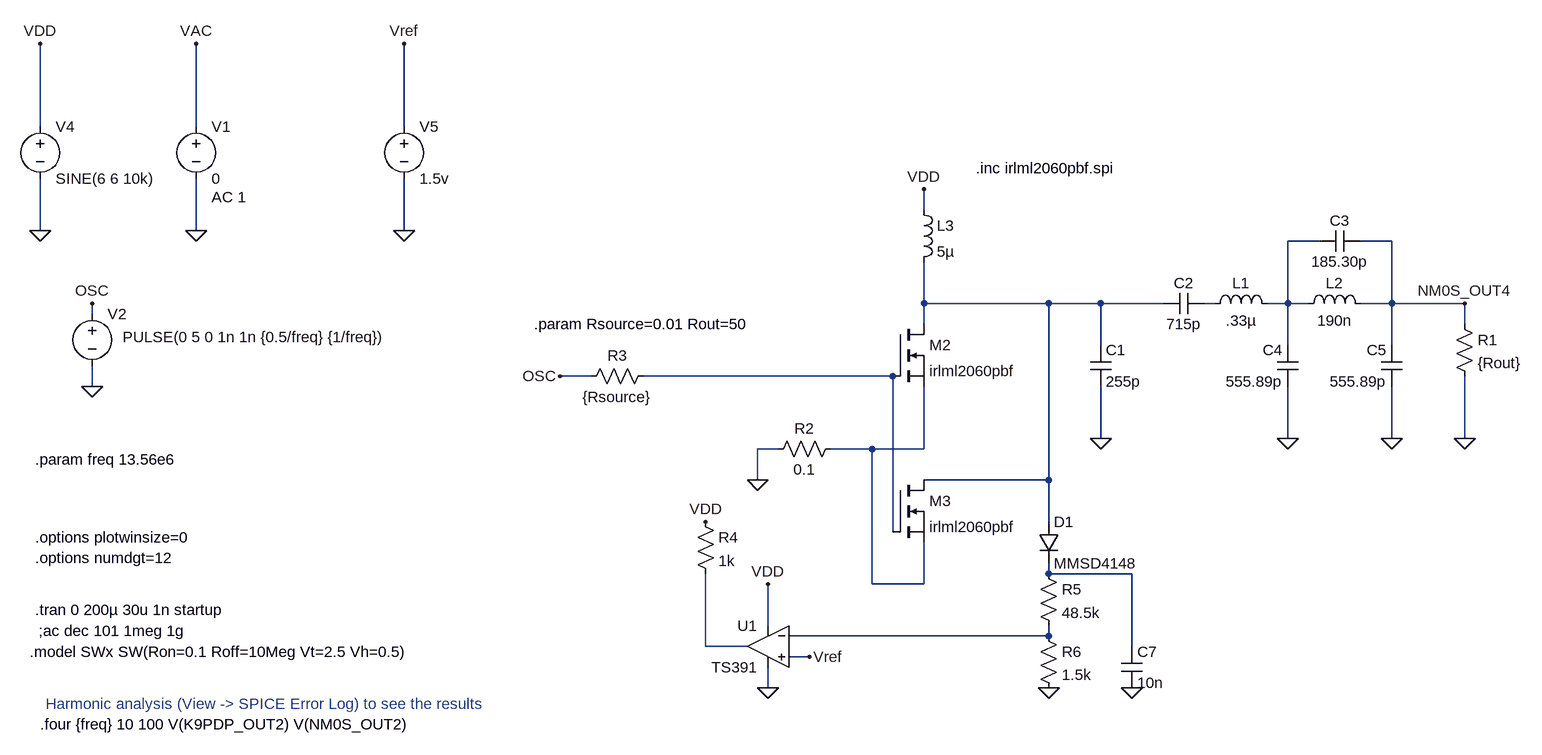
[diagram p0: schematic Class_E_with_transistor_and_gate_driver.asc]
Class_E_with_transistor_and_gate_driver.asc, the LTspice schematic file:
Version 4
SHEET 1 2652 1572
WIRE 352 -48 352 -176
WIRE 592 -48 592 -176
WIRE 912 -48 912 -176
WIRE 1712 80 1712 48
WIRE 352 112 352 32
WIRE 592 112 592 32
WIRE 912 112 912 32
WIRE 2320 128 2272 128
WIRE 2432 128 2384 128
WIRE 1712 224 1712 160
WIRE 1904 224 1712 224
WIRE 1984 224 1904 224
WIRE 2080 224 1984 224
WIRE 2160 224 2144 224
WIRE 2272 224 2272 128
WIRE 2272 224 2240 224
WIRE 2304 224 2272 224
WIRE 2432 224 2432 128
WIRE 2432 224 2384 224
WIRE 2544 224 2432 224
WIRE 432 240 432 224
WIRE 1712 256 1712 224
WIRE 2544 256 2544 224
WIRE 1984 288 1984 224
WIRE 2272 288 2272 224
WIRE 2432 288 2432 224
WIRE 1200 336 1152 336
WIRE 1664 336 1280 336
WIRE 432 352 432 320
WIRE 1984 432 1984 352
WIRE 2272 432 2272 352
WIRE 2432 432 2432 352
WIRE 2544 432 2544 336
WIRE 1488 448 1456 448
WIRE 1632 448 1568 448
WIRE 1712 448 1712 352
WIRE 1712 448 1632 448
WIRE 1456 496 1456 448
WIRE 1904 496 1904 224
WIRE 1904 496 1712 496
WIRE 1904 560 1904 496
WIRE 1664 576 1664 336
WIRE 1904 640 1904 624
WIRE 2032 640 1904 640
WIRE 1632 656 1632 448
WIRE 1712 656 1712 592
WIRE 1712 656 1632 656
WIRE 1472 720 1472 656
WIRE 1904 736 1904 720
WIRE 1904 736 1504 736
WIRE 1376 752 1376 640
WIRE 1440 752 1376 752
WIRE 2032 752 2032 640
WIRE 1536 768 1504 768
WIRE 1472 816 1472 784
FLAG 592 112 0
FLAG 592 -176 VAC
FLAG 432 352 0
FLAG 352 112 0
FLAG 352 -176 VDD
FLAG 432 224 OSC
FLAG 1984 432 0
FLAG 2272 432 0
FLAG 2432 432 0
FLAG 2544 432 0
FLAG 2544 224 NM0S_OUT4
FLAG 1712 48 VDD
FLAG 1152 336 OSC
FLAG 1456 496 0
FLAG 1472 816 0
FLAG 1472 656 VDD
FLAG 1536 768 Vref
FLAG 912 -176 Vref
FLAG 912 112 0
FLAG 1904 816 0
FLAG 2032 816 0
FLAG 1376 560 VDD
SYMBOL voltage 592 -64 R0
WINDOW 123 24 124 Left 2
WINDOW 39 0 0 Left 0
SYMATTR Value2 AC 1
SYMATTR InstName V1
SYMATTR Value 0
SYMBOL voltage 432 224 R0
WINDOW 123 0 0 Left 0
WINDOW 39 0 0 Left 0
WINDOW 3 47 52 Left 2
SYMATTR Value PULSE(0 5 0 1n 1n {0.5/freq} {1/freq})
SYMATTR InstName V2
SYMBOL voltage 352 -64 R0
WINDOW 123 0 0 Left 0
WINDOW 39 0 0 Left 0
SYMATTR InstName V4
SYMATTR Value SINE(6 6 10k)
SYMBOL cap 1968 288 R0
SYMATTR InstName C1
SYMATTR Value 255p
SYMBOL cap 2144 208 R90
WINDOW 0 0 32 VBottom 2
WINDOW 3 32 32 VTop 2
SYMATTR InstName C2
SYMATTR Value 715p
SYMBOL cap 2384 112 R90
WINDOW 0 0 32 VBottom 2
WINDOW 3 32 32 VTop 2
SYMATTR InstName C3
SYMATTR Value 185.30p
SYMBOL cap 2288 352 R180
WINDOW 0 24 56 Left 2
WINDOW 3 24 8 Left 2
SYMATTR InstName C4
SYMATTR Value 555.89p
SYMBOL cap 2448 352 R180
WINDOW 0 24 56 Left 2
WINDOW 3 24 8 Left 2
SYMATTR InstName C5
SYMATTR Value 555.89p
SYMBOL ind 2144 240 R270
WINDOW 0 32 56 VTop 2
WINDOW 3 5 56 VBottom 2
SYMATTR InstName L1
SYMATTR Value .33µ
SYMBOL ind 2288 240 R270
WINDOW 0 32 56 VTop 2
WINDOW 3 5 56 VBottom 2
SYMATTR InstName L2
SYMATTR Value 190n
SYMBOL res 2528 240 R0
SYMATTR InstName R1
SYMATTR Value {Rout}
SYMBOL ind 1696 64 R0
SYMATTR InstName L3
SYMATTR Value 5µ
SYMBOL nmos 1664 256 R0
SYMATTR InstName M2
SYMATTR Value irlml2060pbf
SYMATTR Prefix X
SYMBOL nmos 1664 496 R0
SYMATTR InstName M3
SYMATTR Value irlml2060pbf
SYMATTR Prefix X
SYMBOL res 1296 320 R90
WINDOW 0 0 56 VBottom 2
WINDOW 3 32 56 VTop 2
SYMATTR InstName R3
SYMATTR Value {Rsource}
SYMBOL Parts_TCO\\TS391 1472 688 M0
SYMATTR InstName U1
SYMBOL res 1360 544 R0
SYMATTR InstName R4
SYMATTR Value 1k
SYMBOL voltage 912 -64 R0
WINDOW 123 0 0 Left 0
WINDOW 39 0 0 Left 0
SYMATTR InstName V5
SYMATTR Value 1.5v
SYMBOL diode 1888 560 R0
SYMATTR InstName D1
SYMATTR Value MMSD4148
SYMBOL res 1888 624 R0
SYMATTR InstName R5
SYMATTR Value 48.5k
SYMBOL res 1888 720 R0
SYMATTR InstName R6
SYMATTR Value 1.5k
SYMBOL cap 2016 752 R0
SYMATTR InstName C7
SYMATTR Value 10n
SYMBOL res 1584 432 R90
WINDOW 0 0 56 VBottom 2
WINDOW 3 32 56 VTop 2
SYMATTR InstName R2
SYMATTR Value 0.1
TEXT 576 728 Right 2 !;ac dec 101 1meg 1g
TEXT 336 760 Left 2 !.model SWx SW(Ron=0.1 Roff=10Meg Vt=2.5 Vh=0.5)
TEXT 344 696 Left 2 !.tran 0 200µ 30u 1n startup
TEXT 344 464 Left 2 !.param freq 13.56e6
TEXT 344 616 Left 2 !.options numdgt=12
TEXT 344 584 Left 2 !.options plotwinsize=0
TEXT 352 872 Left 2 !.four {freq} 10 100 V(K9PDP_OUT2) V(NM0S_OUT2)
TEXT 360 840 Left 2 ;Harmonic analysis (View -> SPICE Error Log) to see the results
TEXT 1792 16 Left 2 !.inc irlml2060pbf.spi
TEXT 1112 256 Left 2 !.param Rsource=0.01 Rout=50

The netlist it stands for:
* Class_E_with_transistor_and_gate_driver.asc
V1 VAC 0 0 AC 1
V2 OSC 0 PULSE(0 5 0 1n 1n {0.5/freq} {1/freq})
V4 VDD 0 SINE(6 6 10k)
C1 N002 0 255p
C2 N003 N002 715p
C3 NM0S_OUT4 N001 185.30p
C4 0 N001 555.89p
C5 0 NM0S_OUT4 555.89p
L1 N003 N001 .33µ
L2 N001 NM0S_OUT4 190n
R1 NM0S_OUT4 0 {Rout}
L3 VDD N002 5µ
XM2 N002 N004 N005 irlml2060pbf  ; pins D G S
XM3 N002 N004 N005 irlml2060pbf  ; pins D G S
R3 N004 OSC {Rsource}
* U1: TS391 (symbol Parts_TCO\TS391 not available, pins judged from their places): In+=Vref In-=N007 V+=VDD V-=0 OUT=N008
R4 VDD N008 1k
V5 Vref 0 1.5v
D1 N002 N006 MMSD4148
R5 N006 N007 48.5k
R6 N007 0 1.5k
C7 N006 0 10n
R2 N005 0 0.1
.model D D
.lib standard.dio
;ac dec 101 1meg 1g
.model SWx SW(Ron=0.1 Roff=10Meg Vt=2.5 Vh=0.5)
.tran 0 200µ 30u 1n startup
.param freq 13.56e6
.options numdgt=12
.options plotwinsize=0
.four {freq} 10 100 V(K9PDP_OUT2) V(NM0S_OUT2)
* Harmonic analysis (View -> SPICE Error Log) to see the results
.inc irlml2060pbf.spi
.param Rsource=0.01 Rout=50
.backanno
.end